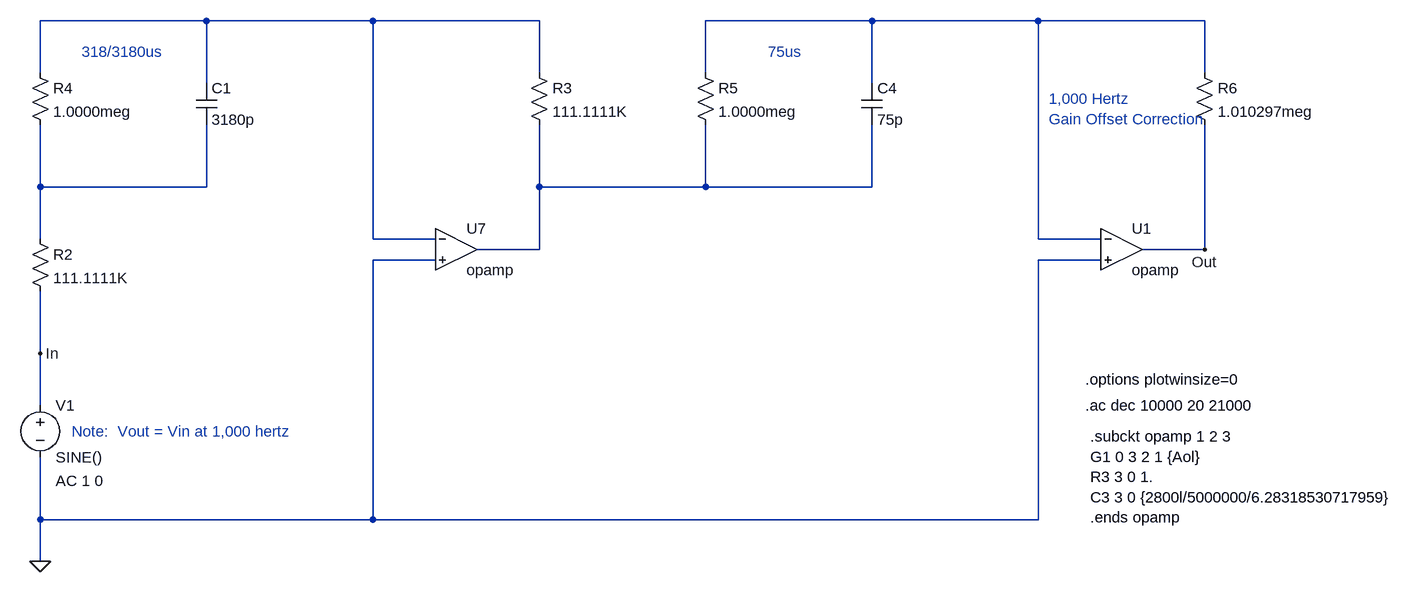
[diagram p0: schematic RIAA Simulator.asc]
RIAA Simulator.asc, the LTspice schematic file:
Version 4
SHEET 1 6256 948
WIRE 3376 -848 3120 -848
WIRE 3632 -848 3376 -848
WIRE 3888 -848 3632 -848
WIRE 4400 -848 4144 -848
WIRE 4656 -848 4400 -848
WIRE 4912 -848 4656 -848
WIRE 3120 -768 3120 -848
WIRE 3888 -768 3888 -848
WIRE 4144 -768 4144 -848
WIRE 4912 -768 4912 -848
WIRE 3376 -752 3376 -848
WIRE 4400 -752 4400 -848
WIRE 3120 -592 3120 -688
WIRE 3376 -592 3376 -688
WIRE 3376 -592 3120 -592
WIRE 3888 -592 3888 -688
WIRE 4144 -592 4144 -688
WIRE 4144 -592 3888 -592
WIRE 4400 -592 4400 -688
WIRE 4400 -592 4144 -592
WIRE 3120 -512 3120 -592
WIRE 3632 -512 3632 -848
WIRE 3728 -512 3632 -512
WIRE 4656 -512 4656 -848
WIRE 4752 -512 4656 -512
WIRE 3888 -496 3888 -592
WIRE 3888 -496 3792 -496
WIRE 4912 -496 4912 -688
WIRE 4912 -496 4816 -496
WIRE 3728 -480 3632 -480
WIRE 4752 -480 4656 -480
WIRE 3120 -336 3120 -432
WIRE 3120 -256 3120 -336
WIRE 3120 -80 3120 -176
WIRE 3632 -80 3632 -480
WIRE 3632 -80 3120 -80
WIRE 4656 -80 4656 -480
WIRE 4656 -80 3632 -80
WIRE 3120 -16 3120 -80
FLAG 3120 -16 0
FLAG 4912 -496 Out
FLAG 3120 -336 In
SYMBOL Opamps\\opamp 3760 -560 R0
SYMATTR InstName U7
SYMATTR SpiceLine Aol=100meg
SYMATTR SpiceLine2 GBW=100Meg
SYMBOL voltage 3120 -272 R0
WINDOW 123 24 132 Left 0
WINDOW 39 0 0 Left 0
SYMATTR Value2 AC 1 0
SYMATTR InstName V1
SYMATTR Value SINE()
SYMBOL res 3872 -784 R0
SYMATTR InstName R3
SYMATTR Value 111.1111K
SYMBOL cap 3360 -752 R0
SYMATTR InstName C1
SYMATTR Value 3180p
SYMBOL res 3104 -784 R0
SYMATTR InstName R4
SYMATTR Value 1.0000meg
SYMATTR SpiceLine tol=0
SYMBOL res 3104 -528 R0
SYMATTR InstName R2
SYMATTR Value 111.1111K
SYMBOL cap 4384 -752 R0
SYMATTR InstName C4
SYMATTR Value 75p
SYMBOL Opamps\\opamp 4784 -560 R0
SYMATTR InstName U1
SYMATTR SpiceLine Aol=100meg
SYMATTR SpiceLine2 GBW=100Meg
SYMBOL res 4896 -784 R0
SYMATTR InstName R6
SYMATTR Value 1.010297meg
SYMATTR SpiceLine tol=0
SYMBOL res 4128 -784 R0
SYMATTR InstName R5
SYMATTR Value 1.0000meg
SYMATTR SpiceLine tol=0
TEXT 4728 -296 Left 0 !.options plotwinsize=0
TEXT 4728 -256 Left 0 !.ac dec 10000 20 21000
TEXT 4736 -208 Left 0 !.subckt opamp 1 2 3\nG1 0 3 2 1 {Aol}\nR3 3 0 1.\nC3 3 0 {2800l/5000000/6.28318530717959}\n.ends opamp
TEXT 3184 -800 Left 0 ;318/3180us
TEXT 4240 -800 Left 0 ;75us
TEXT 4672 -728 Left 0 ;1,000 Hertz \nGain Offset Correction
TEXT 3168 -216 Left 0 ;Note:  Vout = Vin at 1,000 hertz

The netlist it stands for:
* RIAA Simulator.asc
XU7 N001 0 N004 opamp Aol=100meg GBW=100Meg  ; pins invin noninvin out
V1 In 0 SINE() AC 1 0
R3 N001 N004 111.1111K
C1 N001 N003 3180p
R4 N001 N003 1.0000meg tol=0
R2 N003 In 111.1111K
C4 N002 N004 75p
XU1 N002 0 Out opamp Aol=100meg GBW=100Meg  ; pins invin noninvin out
R6 N002 Out 1.010297meg tol=0
R5 N002 N004 1.0000meg tol=0
.options plotwinsize=0
.ac dec 10000 20 21000
.subckt opamp 1 2 3
G1 0 3 2 1 {Aol}
R3 3 0 1.
C3 3 0 {2800l/5000000/6.28318530717959}
.ends opamp
* 318/3180us
* 75us
* 1,000 Hertz
* Gain Offset Correction
* Note:  Vout = Vin at 1,000 hertz
.backanno
.end